# EAGLE design 0131-dcdc-3a (EAGLE 9.6.2)
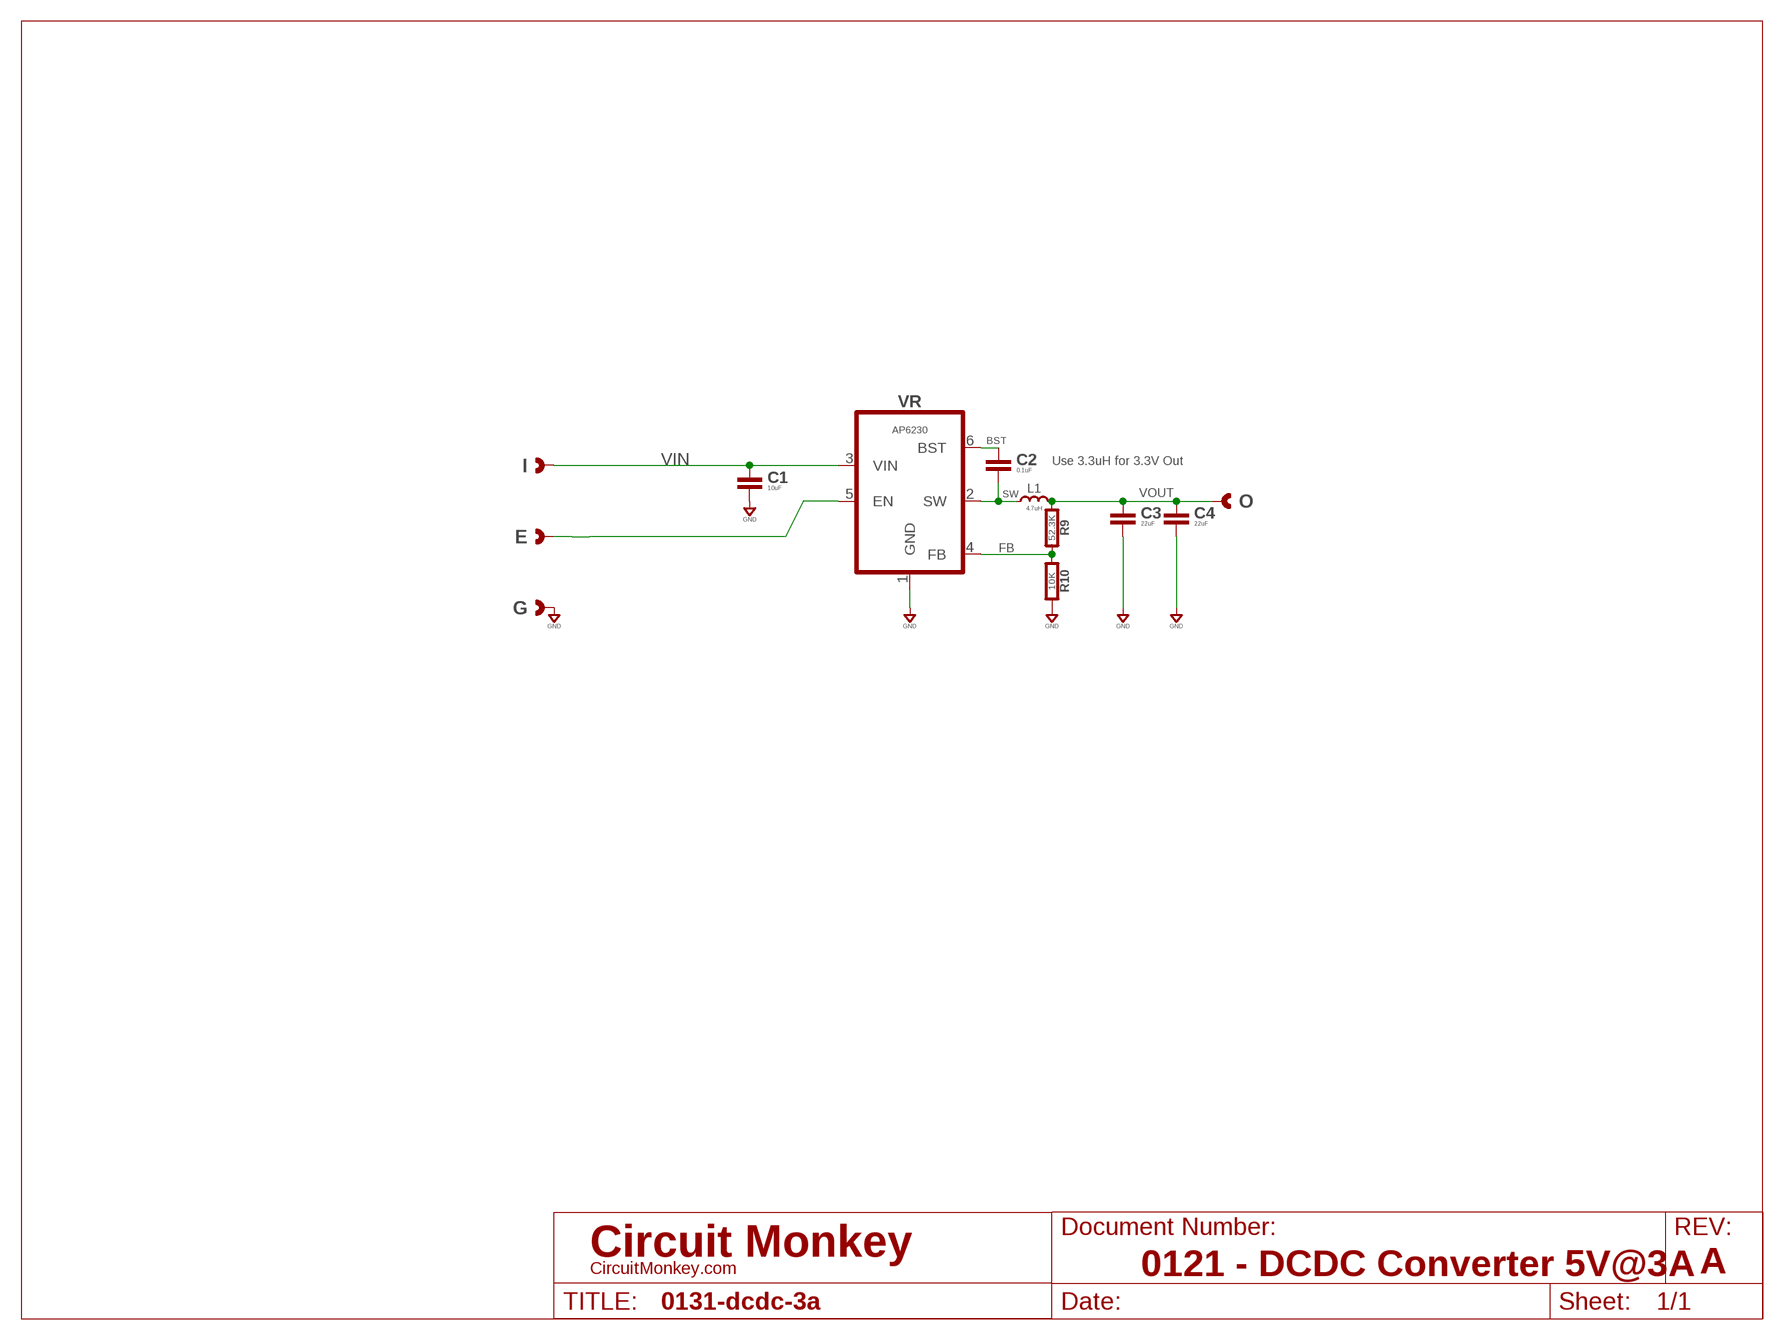
[diagram p0: schematic, sheet 1]
U$1 (LETTER_L-CIRCUITMONKEY): DOCUMENT_NUMBER: 0121 - DCDC Converter 5V@3A; REV: A

## Parts
C1  10uF  CAPACITOR0603  [0603-CAP]
C2  0.1uF  CAPACITOR0603  [0603-CAP]
C3  22uF  CAPACITOR0603  [0603-CAP]
C4  22uF  CAPACITOR0603  [0603-CAP]
E  CAST-01X12.00MM  [CAST01-2.00MM]
G  CAST-01X12.00MM  [CAST01-2.00MM]
I  CAST-01X12.00MM  [CAST01-2.00MM]
L1  4.7uH  INDUCTORSMD-05X04MM  [IND-SRN5040]
O  CAST-01X12.00MM  [CAST01-2.00MM]
R9  52.3K  RESISTOR0603  [0603-RES]
R10  10K  RESISTOR0603  [0603-RES]
VR  AP6230  BUCKAP62300-WU  [TSOT26]

## Nets
BST: C2.1 VR.6(BST)
FB: R9.2 R10.1 VR.4(FB)
GND: C1.2 C3.2 C4.2 G.1 G.P$1 G.P$2 R10.2 VR.1(GND)
N$1: E.1 E.P$1 E.P$2 VR.5(EN)
SW: C2.2 L1.2 VR.2(SW)
VIN: C1.1 I.1 I.P$1 I.P$2 VR.3(VIN)
VOUT: C3.1 C4.1 L1.1 O.1 O.P$1 O.P$2 R9.1

## Notes on the sheet
- Use 3.3uH for 3.3V Out

## Library data of the parts
C1-C4 = rlc:CAPACITOR: Capacitor; COST01: 0.12; COST10: 0.09; COST100: 0.05
E G I O = con-headers:CAST-01X1: Castelated Edge Hole Pad
L1 = rlc:INDUCTOR: Inductor; COST01: 0.55; COST10: 0.40; COST100: 0.35; MFR: Bourns; MPN: SRN5040-3R3M
R9 R10 = rlc:RESISTOR: Resistor; COST01: 0.10; COST10: 0.05; COST100: 0.02
VR = regulators:BUCK: Buck Regulator; COST01: 0.50; COST10: 0.42; COST100: 0.30; MFR: Diodes, Inc.; MPN: AP62300WU

## Board
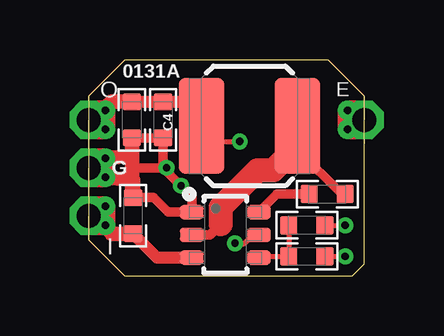
[diagram p1: board, top side]
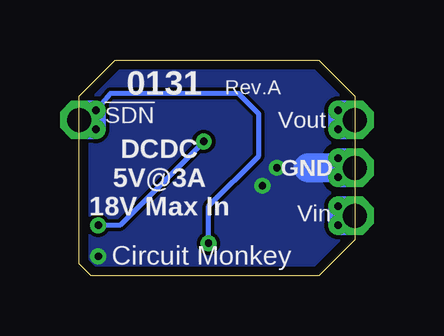
[diagram p2: board, bottom side, seen from below]

Size 11.5 x 9 mm. Coordinates in mm from the lower left corner, seen from the top.
Outline: 1.5,0 11,0 11.5,0.5 11.5,7.5 10,9 1.5,9 0,7.5 0,1.5 1.5,0
Copper layers (1*16): Top 0.0712mm / dielectric 0.657mm / Bottom 0.0712mm
Design rules "OSH-CircuitMonkey-thin": minimum track width 6mil, minimum drill 12mil, track to track 6mil, track to pad 6mil, pad to pad 6mil, via to via 6mil, smd to smd 6mil, copper to edge 15mil, drill to drill 6mil, minimum pad ring 7mil, minimum via ring 7mil, stop-mask expansion 3mil, vias tented up to drill 14mil, thermal gap 10mil

### Footprints (pad centres in the part's own frame; a part is rotated, then mirrored left to right if it is on the bottom)
0603-CAP = smd 0.711 x 0.762: 1 -0.752,0; 2 0.752,0
CAST01-2.00MM = drill 1 pad 1.6 octagon: 1 0,0 | drill 0.305 pad 0.813: P$1 -0.7,0.4; P$2 -0.7,-0.4
IND-SRN5040 = smd 1.9 x 4: 1 -2,0; 2 2,0
0603-RES = smd 0.711 x 0.762: 1 -0.752,0; 2 0.752,0
TSOT26 = smd 0.6 x 1: 1 -0.95,-1.4; 2 0,-1.4; 3 0.95,-1.4; 4 0.95,1.4; 5 0,1.4; 6 -0.95,1.4

### Placement (x,y rotation side)
C1  1.85,2.5 90 top
C2  9.95,3.4 0 top
C3  1.8,6.5 270 top
C4  3.1,6.5 270 top
E  11.5,6.5 0 top
G  0,4.5 180 top
I  0,2.5 180 top
L1  6.7,6.25 0 top
O  0,6.5 180 top
R9  9.1,2.1 180 top
R10  9.1,0.8 0 top
VR  5.7,1.7 270 top

### Tracks (layer width: path | path; a pad name or v marks a point on that pad's centre or on a via)
BST
  Top 0.4: VR.6 7.85,3.4 C2.1
FB
  Top 0.2: VR.4 7.15,0.8 R10.1 R9.2
GND  (via drill 0.3)
  Top 0.2: G.1 0.5,5 G.P$2 | R10.2 v10.7,0.8
  Top 0.4: C1.2 2.7,3.25 3.3,2.65 VR.1 4.3,3.3 v3.85,3.75 3.25,4.35 v3.25,4.5 | C3.2 C4.2 3.1,4.65 v3.25,4.5 | v3.25,4.5 1.8,4.5
  Top 0.6: G.P$2 1.8,5 C3.2 1.8,4.5 1.8,3.3 C1.2 1.85,4 G.P$1
  Bottom 1.2: G.1 1.95,4.5
  pour Bottom (rank 5): 11,0 1.5,0 0,1.5 0,7.5 1.5,9 10,9 11.5,7.5 11.5,0.5
N$1  (via drill 0.3)
  Top 0.2: VR.5 6.85,1.7 6.45,1.3 6.15,1.3 v6.1,1.35
  Bottom 0.2: v6.1,1.35 6.1,2.9 4,5 4,6.75 4.85,7.6 10.2,7.6 E.P$1 11,7 E.1 11.3,6.5 E.P$2
SW
  Top 0.4: VR.2 5.05,1.7 5.5,2.15 | C2.2 10.55,3.4 8.72,5.22
  Top 1: 5.5,2.15 5.5,2.85 7.05,4.4 7.7,4.4 8.65,5.35 | 8.65,5.35 8.7,5.4 L1.2 | 8.72,5.22 8.65,5.15 8.65,5.35
VIN
  Top 0.2: I.P$2 0.5,3 I.1 0.5,2 I.P$1
  Top 0.5: VR.3 2.85,0.75 C1.1
  Top 0.6: I.P$1 0.95,1.75 C1.1
VOUT  (via drill 0.3)
  Top 0.2: O.P$2 0.5,7 O.1 0.5,6 O.P$1 | L1.1 5.35,5.6 v6.3,5.6 | R9.1 v10.7,2.1
  Top 0.5: L1.1 4.7,6.85 4.3,7.25 C4.1 C3.1
  Top 0.6: C3.1 0.95,7.25 0.7,7 O.P$2
  Bottom 0.2: v6.3,5.6 9.8,2.1 v10.7,2.1

### Text on the board
tPlace: 0131A
bPlace: Rev.A | 0131 | !SDN | Vout | GND | DCDC / 5V@3A / 18V Max In | Vin | Circuit Monkey